# EAGLE schematic Emitters (EAGLE 9.5.2)
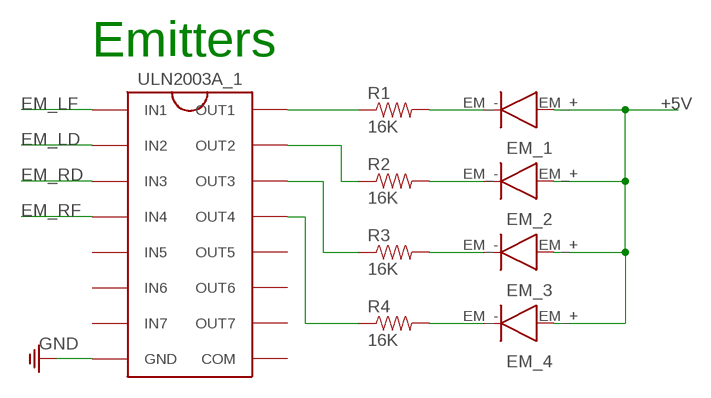
[diagram p0: schematic, sheet 1]

## Parts
EM_1  SFH4545  [EMITTER]
EM_2  SFH4545  [EMITTER]
EM_3  SFH4545  [EMITTER]
EM_4  SFH4545  [EMITTER]
R1  16K  RESISTOR_0805IN_2012MM  [0805]
R2  16K  RESISTOR_0805IN_2012MM  [0805]
R3  16K  RESISTOR_0805IN_2012MM  [0805]
R4  16K  RESISTOR_0805IN_2012MM  [0805]
ULN2003A_1  ULN2003A  [ULN2003A]

## Nets
+5V: EM_1.EM_+(+) EM_2.EM_+(+) EM_3.EM_+(+) EM_4.EM_+(+)
EM_LD: ULN2003A_1.2B(IN2)
EM_LF: ULN2003A_1.1B(IN1)
EM_RD: ULN2003A_1.3B(IN3)
EM_RF: ULN2003A_1.4B(IN4)
GND: ULN2003A_1.GND
N$1: R1.1 ULN2003A_1.1C(OUT1)
N$2: R2.1 ULN2003A_1.2C(OUT2)
N$3: R3.1 ULN2003A_1.3C(OUT3)
N$4: R4.1 ULN2003A_1.4C(OUT4)
N$5: EM_1.EM_-(-) R1.2
N$6: EM_2.EM_-(-) R2.2
N$7: EM_3.EM_-(-) R3.2
N$8: EM_4.EM_-(-) R4.2
Unconnected: ULN2003A_1.5B(IN5) ULN2003A_1.5C(OUT5) ULN2003A_1.6B(IN6) ULN2003A_1.6C(OUT6) ULN2003A_1.7B(IN7) ULN2003A_1.7C(OUT7) ULN2003A_1.COM

## Notes on the sheet
- Emitters

## Library data of the parts
EM_1-EM_4 = SFH4545:SFH4545
R1-R4 = RESISTOR_0805IN_2012MM:RESISTOR_0805IN_2012MM
ULN2003A_1 = ULN2003A:ULN2003A